# EAGLE design BLM Badge rev B (EAGLE 9.6.2)
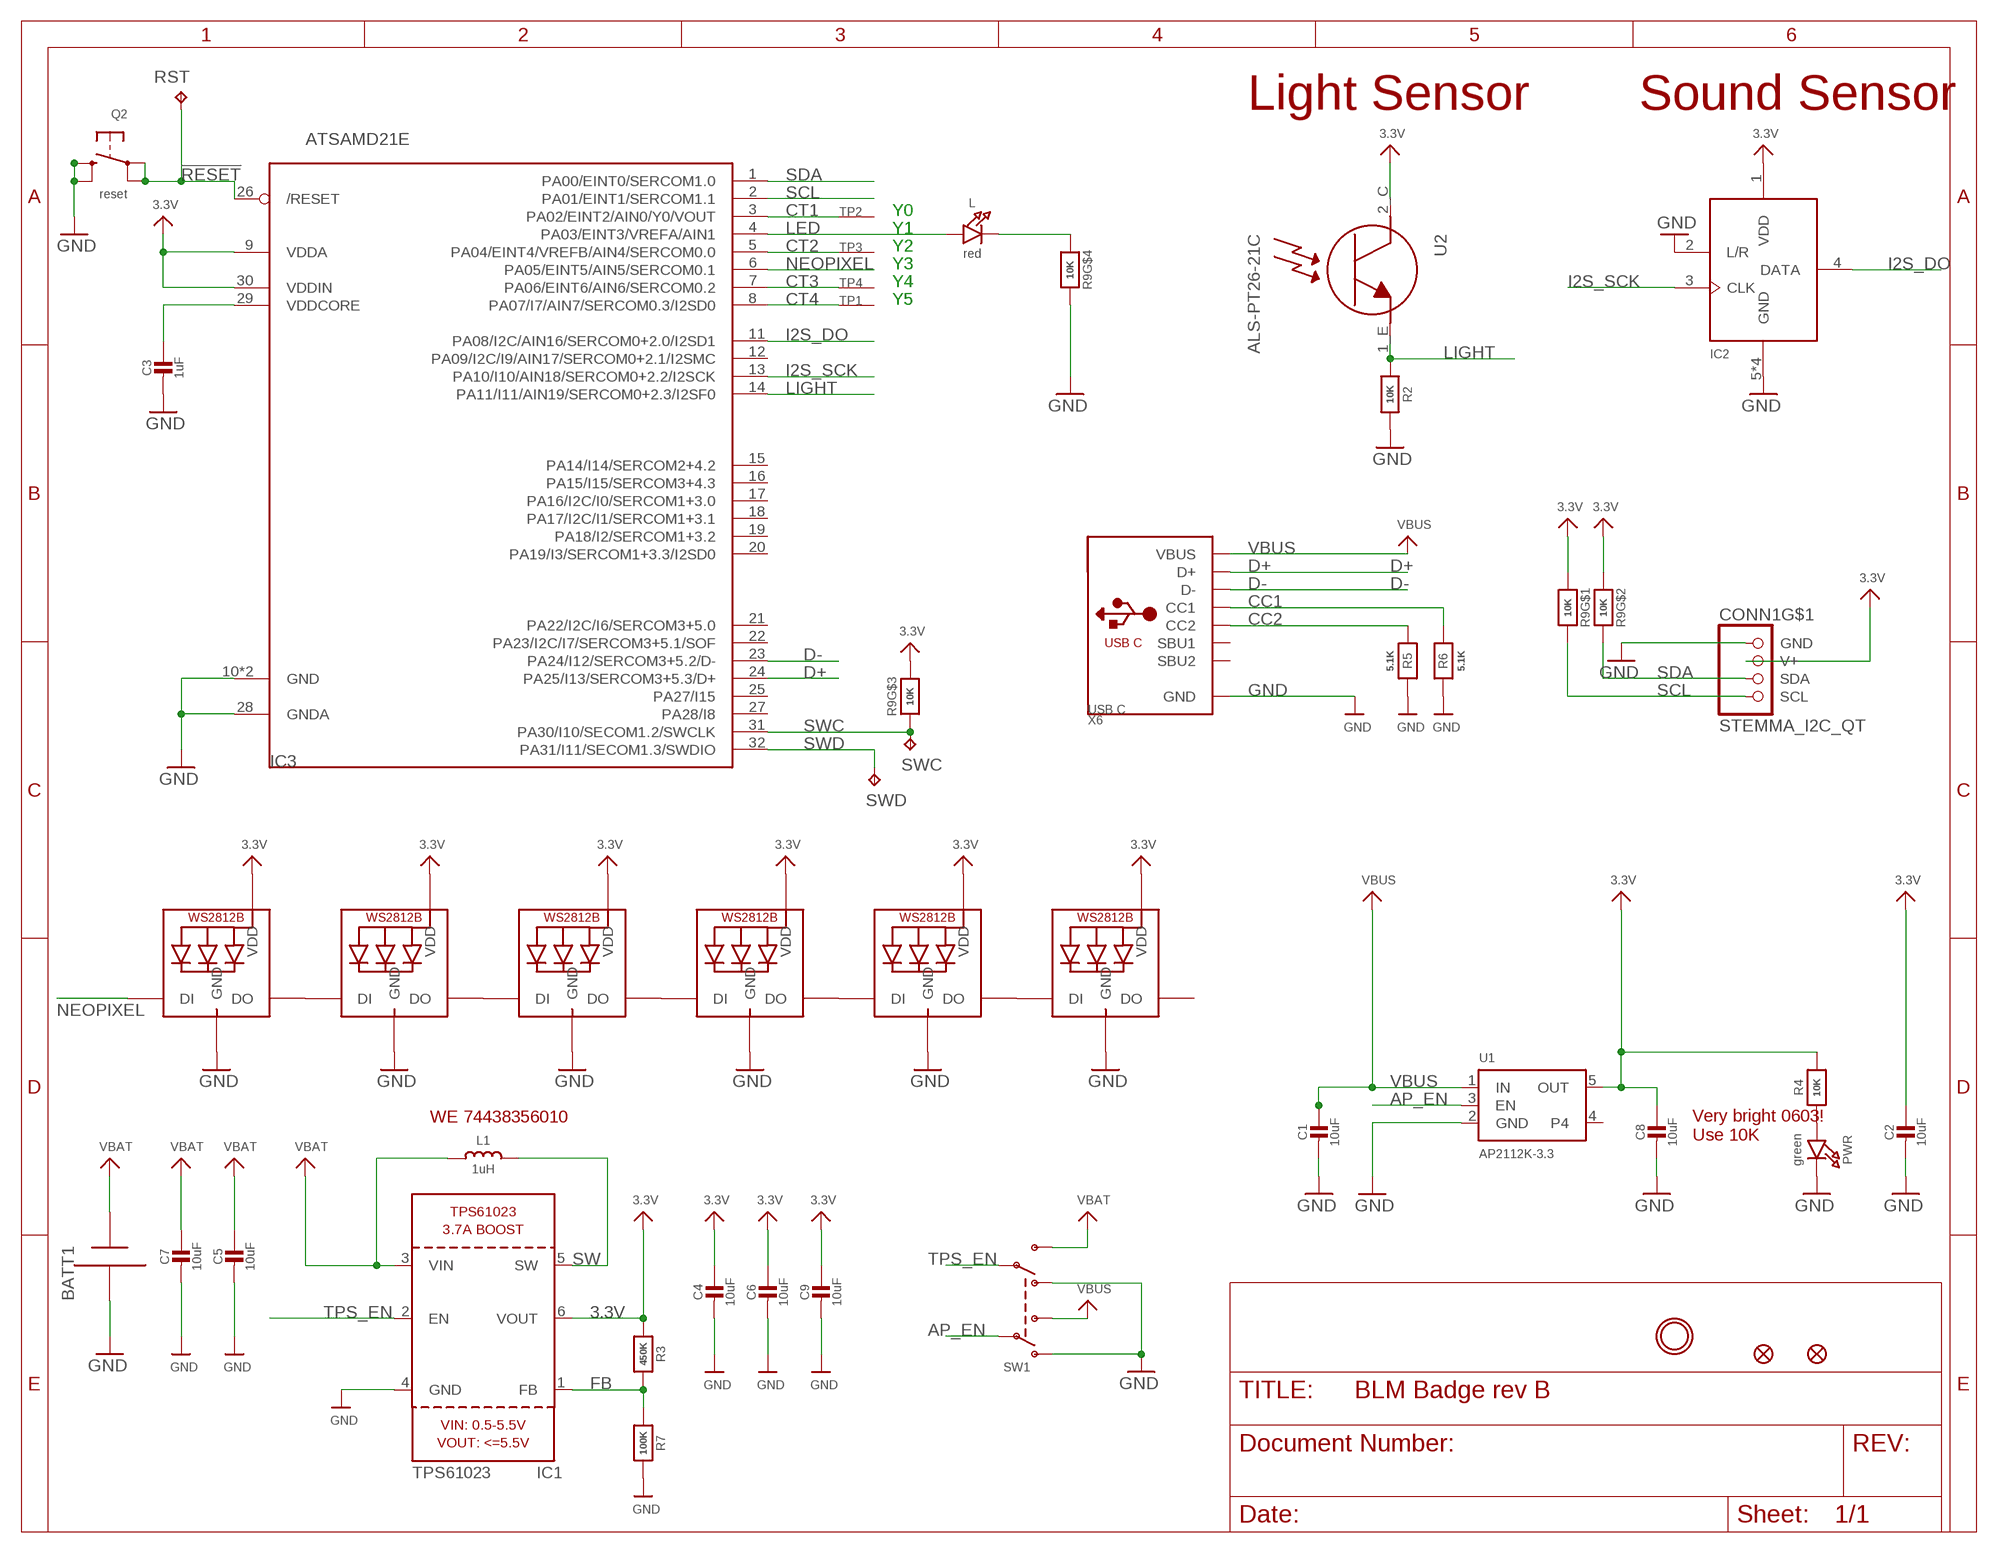
[diagram p0: schematic, sheet 1]

## Parts
BATT1  BATTERYHOLDER_2XAAA  [2XAAA]
C1  10uF  CAP_CERAMIC0805-NOOUTLINE  [0805-NO]
C2  10uF  CAP_CERAMIC0805-NOOUTLINE  [0805-NO]
C3  1uF  CAP_CERAMIC0603_NO  [0603-NO]
C4  10uF  CAP_CERAMIC0805-NOOUTLINE  [0805-NO]
C5  10uF  CAP_CERAMIC0805-NOOUTLINE  [0805-NO]
C6  10uF  CAP_CERAMIC0805-NOOUTLINE  [0805-NO]
C7  10uF  CAP_CERAMIC0805-NOOUTLINE  [0805-NO]
C8  10uF  CAP_CERAMIC0805-NOOUTLINE  [0805-NO]
C9  10uF  CAP_CERAMIC0805-NOOUTLINE  [0805-NO]
CONN1  STEMMA_I2C_QT  [JST_SH4]
FID1  FIDUCIAL_1MM  [FIDUCIAL_1MM]
FID2  FIDUCIAL_1MM  [FIDUCIAL_1MM]
IC1  TPS61023  [SOT563]
IC2  MIC_PDM  MIC_PDM_SPK0415  [SPK0415HM4H]
IC3  ATSAMD21E  [QFN32_5MM]
L  red  LED0603_NOOUTLINE  [CHIPLED_0603_NOOUTLINE]
L1  1uH  INDUCTORTDK_VLC5045  [INDUCTOR_5X5MM_TDK_VLC5045]
LED2  WS2812B_4020  [WS2812B_4020]
LED3  WS2812B_4020  [WS2812B_4020]
LED4  WS2812B_4020  [WS2812B_4020]
LED5  WS2812B_4020  [WS2812B_4020]
LED6  WS2812B_4020  [WS2812B_4020]
LED7  WS2812B_4020  [WS2812B_4020]
PWR  green  LED0603_NOOUTLINE  [CHIPLED_0603_NOOUTLINE]
Q2  reset  SWITCH_TACT_SMT4.6X2.8  [BTN_KMR2_4.6X2.8]
R2  10K  RESISTOR_0603_NOOUT  [0603-NO]
R3  450K  RESISTOR_0603_NOOUT  [0603-NO]
R4  10K  RESISTOR_0603_NOOUT  [0603-NO]
R5  5.1K  RESISTOR_0603_NOOUT  [0603-NO]
R6  5.1K  RESISTOR_0603_NOOUT  [0603-NO]
R7  100K  RESISTOR_0603_NOOUT  [0603-NO]
R9  10K  RESISTOR_4PACK  [RESPACK_4X0603]
RST  TPTP17R  [TP17R]
SW1  SWITCH_DPDTEG1390  [EG1390]
SWC  TPTP17R  [TP17R]
SWD  TPTP17R  [TP17R]
TP1  SEWTAPPCB_ALLIGATOR  [PCB_ALLI]
TP2  SEWTAPPCB_ALLIGATOR  [PCB_ALLI]
TP3  SEWTAPPCB_ALLIGATOR  [PCB_ALLI]
TP4  SEWTAPPCB_ALLIGATOR  [PCB_ALLI]
U1  AP2112K-3.3  VREG_SOT23-5  [SOT23-5]
U2  ALS-PT26-21C  PHOTOTRANSISTOR_PT26-21C  [ALS-PT26-21C]
U$33  MOUNTINGHOLE3.0THIN  [MOUNTINGHOLE_3.0_PLATEDTHIN]
X6  USB C  USB_C  [USB_C_CUSB31-CFM2AX-01-X]

## Nets
3.3V: C2.1 C4.1 C6.1 C8.1 C9.1 CONN1.2(V+) IC1.6(VOUT) IC2.1(VDD) IC3.9(VDDA) IC3.30(VDDIN) LED2.2(VDD) LED3.2(VDD) LED4.2(VDD) LED5.2(VDD) LED6.2(VDD) LED7.2(VDD) R3.1 R4.2 R9.1 R9.2 R9.6 U1.5(OUT) U2.2_C(C)
!RESET: IC3.26(/RESET) Q2.A'(P1) Q2.A(P) RST.TP
AP_EN: SW1.P1 U1.3(EN)
CC1: R6.2 X6.A5(CC1)
CC2: R5.2 X6.B5(CC2)
CT1: IC3.3(PA02/EINT2/AIN0/Y0/VOUT) TP2.P$1(SEW)
CT2: IC3.5(PA04/EINT4/VREFB/AIN4/SERCOM0.0) TP3.P$1(SEW)
CT3: IC3.7(PA06/EINT6/AIN6/SERCOM0.2) TP4.P$1(SEW)
CT4: IC3.8(PA07/I7/AIN7/SERCOM0.3/I2SD0) TP1.P$1(SEW)
D+: IC3.24(PA25/I13/SERCOM3+5.3/D+) X6.A6(D+) X6.B6(D+)
D-: IC3.23(PA24/I12/SERCOM3+5.2/D-) X6.A7(D-) X6.B7(D-)
FB: IC1.1(FB) R3.2 R7.1
GND: BATT1.MINUS(-) C1.2 C2.2 C3.2 C4.2 C5.2 C6.2 C7.2 C8.2 C9.2 CONN1.1(GND) IC1.4(GND) IC2.2(L/R) IC2.5(GND) IC2.6(GND) IC2.7(GND) IC2.8(GND) IC3.10(GND) IC3.28(GNDA) IC3.33(GND) LED2.4(GND) LED3.4(GND) LED4.4(GND) LED5.4(GND) LED6.4(GND) LED7.4(GND) PWR.C Q2.B'(S1) Q2.B(S) R2.1 R5.1 R6.1 R7.2 R9.5 SW1.O1 SW1.O2 U1.2(GND) X6.A1B12(GND) X6.B1A12(GND)
I2S_DO: IC2.4(DATA) IC3.11(PA08/I2C/AIN16/SERCOM0+2.0/I2SD1)
I2S_SCK: IC2.3(CLK) IC3.13(PA10/I10/AIN18/SERCOM0+2.2/I2SCK)
LED: IC3.4(PA03/EINT3/VREFA/AIN1) L.A
LIGHT: IC3.14(PA11/I11/AIN19/SERCOM0+2.3/I2SF0) R2.2 U2.1_E(E)
N$1: L.C R9.4
N$6: PWR.A R4.1
N$10: LED2.3(DO) LED3.1(DI)
N$11: LED3.3(DO) LED4.1(DI)
N$12: LED4.3(DO) LED5.1(DI)
N$13: LED6.3(DO) LED7.1(DI)
N$16: LED5.3(DO) LED6.1(DI)
NEOPIXEL: IC3.6(PA05/EINT5/AIN5/SERCOM0.1) LED2.1(DI)
SCL: CONN1.4(SCL) IC3.2(PA01/EINT1/SERCOM1.1) R9.8
SDA: CONN1.3(SDA) IC3.1(PA00/EINT0/SERCOM1.0) R9.7
SW: IC1.5(SW) L1.P$2
SWC: IC3.31(PA30/I10/SECOM1.2/SWCLK) R9.3 SWC.TP
SWD: IC3.32(PA31/I11/SECOM1.3/SWDIO) SWD.TP
TPS_EN: IC1.2(EN) SW1.P2
VBAT: BATT1.PLUS(+) C5.1 C7.1 IC1.3(VIN) L1.P$1 SW1.S2
VBUS: C1.1 SW1.S1 U1.1(IN) X6.A4B9(VBUS) X6.B4A9(VBUS)
VDDCORE: C3.1 IC3.29(VDDCORE)
Unconnected: CONN1.MT1(MT) CONN1.MT2(MT) IC3.12(PA09/I2C/I9/AIN17/SERCOM0+2.1/I2SMC) IC3.15(PA14/I14/SERCOM2+4.2) IC3.16(PA15/I15/SERCOM3+4.3) IC3.17(PA16/I2C/I0/SERCOM1+3.0) IC3.18(PA17/I2C/I1/SERCOM1+3.1) IC3.19(PA18/I2/SERCOM1+3.2) IC3.20(PA19/I3/SERCOM1+3.3/I2SD0) IC3.21(PA22/I2C/I6/SERCOM3+5.0) IC3.22(PA23/I2C/I7/SERCOM3+5.1/SOF) IC3.25(PA27/I15) IC3.27(PA28/I8) LED7.3(DO) U1.4 X6.A8(SBU1) X6.B8(SBU2)

## Notes on the sheet
- Light Sensor | Sound Sensor
- Y0
- Y1
- Y2
- Y3
- Y4
- Y5
- WE 74438356010
- Very bright 0603!
  Use 10K

## Library data of the parts
BATT1 = adafruit_power:BATTERYHOLDER: AAA PC pin holder Mouser part #12BH412 - but pretty much any 1x AAA battery holder should be the same http://www.ladyada.net/library/pcb/eaglelibrary.html
C1-C9 = microbuilder:CAP_CERAMIC: Ceramic Capacitors For new designs, use the packages preceded by an '_' character since they are more reliable: The following footprints should be used on most boards: _0402 - Standard footprint for regular board layouts _0603 - Standard footprint for regular board layouts _0805 - Standard footprint for regular board layouts _1206 - Standard footprint for regular board layouts For extremely tight-pitch boards where space is at a premium, the following 'micro-pitch' footprints can be used (smaller pads, no silkscreen outline, etc.): _0402MP - Micro-pitch footprint for very dense/compact boards _0603MP - Micro-pitch footprint for very dense/compact boards _0805MP - Micro-pitch footprint for very dense/compact boards _1206MP - Micro-pitch footprint for very dense/compact boards
CONN1 = microbuilder:STEMMA_I2C
FID1 FID2 = microbuilder:FIDUCIAL: Fiducial Alignment Points Various fiducial points for machine vision alignment.; BOM: EXCLUDE
IC1 = adafruit_power:TPS61023
IC2 = microbuilder:MIC_PDM
IC3 = adafruit_micro:ATSAMD21E
L PWR = microbuilder:LED: LED 0603 - 0603 Surface Mount Package 2mA: Green LED - Low Power (3.9mcd, 2ma, 1.7Vf) - Digikey: 475-2709-2-ND Orange LED - Low Power (9.8mcd, 2ma, 1.8Vf) - Digikey: 475-1194-2-ND Red LED - Low Power (5mcd, 2ma, 1.8Vf) - Digikey: 475-1195-2-ND Yellow LED - Low Power (7mcd, 2ma, 1.8Vf) - Digikey: 475-1196-2-ND 5mA: Blue LED - Low Power (17mcd, 5ma, 2.9Vf) - Digikey: LNJ937W8CRACT-ND 0805 - 0805 Surface Mount Package 2mA: Red LED (8.8mcd, 2mA, 1.8Vf, Clear) - Low Power [Digikey: 475-2510-1-ND] Green LED (5mcd, 2mA, 1.8Vf, Clear) - Low Power [Digikey: 475-2730-1-ND] Yellow LED (11.3mcd, 2mA, 1.8Vf, Clear) - Low Power [Digikey: 475-2555-1-ND] 20mA: Red LED (104mcd, 20mA, Diffused) - LS R976 [Digikey: 475-1278-6-ND] Red LED (12mcd, 20mA, 2.0Vf, Clear) - APT2012EC [Digikey: 754-1128-1-ND] Green LED (15mcd, 20mA, 2.2Vf, Clear) - APT2012GC [Digikey: 754-1131-1-ND] Orange LED (160mcd, 20mA, 2.1Vf, Clear) - APT2012SECK [Digikey: 754-1130-1-ND] 1206 - 1206 Surface Mount Package Green LED (26mcd, 20mA, Diffused) - LG N971 [Digikey: 475-1407-6-ND] Red LED (15mcd, 20mA, Diffused) - LH N974 [Digikey: 475-1416-6-ND] Cree - Cree High-Power Surface Mount LEDs XPEBWT-L1-0000-00D50 - White 111lm 350mA 2.9Vf 6200K 110° XTEAWT-00-0000-00000LEE3 - White 114lm 350mA 2.85Vf 5000K 115° Everlight - Everlight 45-21 Series Surface Mount LEDs 45-21/QK2C-B2832AC2CB2/2T - Warm White 2000mcd 20mA 3.25Vf 3050K 120° 45-21/LK2C-B38452C4CB2/2T - Nuetral White 2000mcd 20mA 3.25Vf 4150K 120° 45-21/LK2C-B50634C6CB2/2T - Cold White 2200mcd 20mA 3.25Vf 5650K 120° PLCC2 Reverse Mount LS T77K-J1L2-1-0-2-R18-Z - Red 11.25mcd 2mA 1.8Vf 630nm 120° LO T77K-L1M2-24-Z - Orange 19.6mcd 2mA 1.8Vf 606nm 120° LY T77K-K2M1-26-Z - Yellow 15.7mcd 2mA 1.8Vf 587nm 120°
L1 = microbuilder:INDUCTOR: Inductors 0603: 10nH Ceramic Inductor - microwire antenna/RF (Digikey: 712-1434-2-ND) 0805: 560nH Ceramic Inductor - RF (Digikey: 553-1047-1-ND) 270nH Ceramic Inductor - Q = 40@250MHz, +-5%, 1 Ohm DC Resistance (Digikey: 535-10506-2-ND) 1007 (2518 Metric) SMT: 10µH 10% 250mOhm 820mA 1007 Inductor (Digikey: 587-2189-1-ND) 22µH 10% 500mOhm 580mA 1007 Inductor (Digikey: 587-2190-1-ND) 47µH 10% 950mOhm 420mA 1007 Inductor (Digikey: 587-2191-1-ND) 47µH 5% 100mOhm 1A 1008 Inductor (Digikey: 732-1816-1-ND) 5.0x5.0mm (Taiyo Yuden NR5040 Series) 6.8µH 20% 2.3A 64mOhm Inductor (Digikey: 587-2374-2-ND) 5.0x5.0mm (TDK VLC5045 Series) 4.7µH 20% 3.3A 34mOhm Inductor (Digikey: 445-6526-1-ND) 6.8µH 20% 2.7A 46mOhm Inductor (Digikey: 445-6527-1-ND) 6.0x6.0mm (TDK VLC6045 Series) 4.7µH 20% 3.8A 27mOhm Inductor (Digikey: 445-6538-2-ND) 6.8µH 20% 3A 41mOhm Inductor (Digikey: 445-6540-1-ND) 6.2µH 30% 2.2A 45mOhm Inductor (Digikey: SRR5028-6R2YCT-ND) - Not TDK VLC6045 but footprint should match 6.0x6.0mm (TDK SLF6045 Series) 6.8uH 30% 2A 33mOhm Inductor (Digikey: 445-4572-1-ND, Mouser: 810-SLF645T6R8N2R0PF) 6.0x6.0mm (Sumida CDRH5D28 Series) 6.2uH 30% 1.8A 45mOhm Inductor (Digikey: 308-1542-1-ND) Taiyo Yuden NR3015T2R2M - 2.2uH 20% 1.5A (Digikey: 587-1648-2-ND, Mouser: 963-NR3015T2R2M) - Used with TI TPS62172 CoilCraft RFID Transponder Coil - MA5532-AE (For use with AS3935 Lightning Sensor) Taiyo Yuden NRH2412T2R2MNGH - 2.2uH 20% 1AA (Digikey: 587-3443-1-ND) - Used with TI LM3671 Vishay IHLP 1.0uH Molded Inductor - 24mOhm DCR, 5A, +/-20%, -55°C-125°C (Digikey: 541-1319-1-ND)
LED2-LED7 = microbuilder:WS2812B
Q2 = microbuilder:SWITCH_TACT_SMT: SMT Tact Switches 6x6mm - Digikey: P12940SCT-ND KMR2 (4.6x2.8mm) - Digikey: 401-1426-1-ND EVQ-PQHB55 - Light Touch, 160GF (4.5x4.5mm) - Digikey: P8090SCT-ND KMT0 - KMT021 NGJ LHS (etc.) IP68/Waterproof - Digikey: CKN10289CT-ND
R2-R7 = microbuilder:RESISTOR: Resistors For new designs, use the packages preceded by an '_' character since they are more reliable: The following footprints should be used on most boards: _0402 - Standard footprint for regular board layouts _0603 - Standard footprint for regular board layouts _0805 - Standard footprint for regular board layouts _1206 - Standard footprint for regular board layouts For extremely tight-pitch boards where space is at a premium, the following 'micro-pitch' footprints can be used (smaller pads, no silkscreen outline, etc.): _0402MP - Micro-pitch footprint for very dense/compact boards _0603MP - Micro-pitch footprint for very dense/compact boards _0805MP - Micro-pitch footprint for very dense/compact boards _1206MP - Micro-pitch footprint for very dense/compact boards
R9 = microbuilder:RESISTOR_4PACK: Resistor Packs (4 resistors) 4 x 0603 10K 1/16W - Digikey: YC164J-10KCT-ND
RST SWC SWD = testpad:TP: Test pad
SW1 = microbuilder:SWITCH_DPDT: Switch - DPDT A DPDT Switch acts like an SPDT switch, but has a pair of switches instead of just one. Vertical - 0.3A @ 6V SMT - Digikey: JS202011SCQN
TP1-TP4 = microbuilder:SEWTAP
U1 = microbuilder:VREG_SOT23-5: SOT23-5 Fixed Voltage Regulators Part Current Out V Out V In V Dropout θJA (°C/W) TJ (°C) Digikey Part No. ADP121 150mA 3.3V 3.4-5.5V 0.09V @ 150mA -- -- ADP121-AUJZ33R7CT-ND ADP121 150mA 3.0V 3.1-5.5V 0.09V @ 150mA -- -- ADP121-AUJZ30R7CT-ND ADP122 300mA 3.3V 3.4-5.5V 0.085V @ 300mA -- -- ADP122AUJZ-3.3-R7CT-ND ADP1712 300mA 3.3V 3.5-5.5V 0.17V @ 300mA -- -- ADP1712AUJZ-3.3-R7TR-ND AP7311 (Low Cost) 150mA 3.3V 3.5-6V 0.15V @ 150mA -- -- AP7311-33WG-7DICT-ND LD39015M18R 150mA 1.8V 1.9V-5.5V 0.08V @ 100mA -- -- 497-6977-1-ND LP2985A-33DBVR 150mA 3.3V 3.3-16V 0.28V @ 150mA 206 150 296-18479-1-ND MCP1824T-3302E/OT 300mA 3.3V 3.5V-6V 0.2V @ 300mA -- -- MCP1824T-3302E/OTCT-ND MIC5205-2.5YM5 TR 150mA 2.5V 2.7-16V 0.165V @ 150mA -- -- 576-1257-2-ND MIC5205-3.0YM5 TR 150mA 3.0V 3.2V-16V 0.165V @ 150mA -- -- 576-1258-2-ND MIC5205-3.3YM5 TR 150mA 3.3V 3.5V-16V 0.165V @ 150mA -- -- 576-1259-2-ND TPS780330220 150mA 3.3V+2.2V 3.6-5.5V 250mV Max -- -- 296-23332-1-ND TDA3663/N1,135 100mA 3.3V 3.5-45V 0.18V @ 50mA -- -- 568-5343-1-ND Max operating temp can be calculated using θJA, TJ (max junction temperature), and power in watts. Set the "Maximum Ambient Temperature" until it reaches TJ ("Max Junction Temperature"), which is the absolute limit for safe use of the regulator: Heat Sink Temperature Calculator <http://www.daycounter.com/Calculators/Heat-Sink-Temperature-Calculator.phtml> For example, With 12V source into a 3.3V LP2985 and a 30mA load, we are dissipating (12V-3.3V) * 0.03A = 0.261W. With a θJA of 206 °C/W, a TJ of 150°C, and 261mW we can safely use the chip without a heat sink up to 75°C (=147.1°C Junction Temperature).
U2 = microbuilder:PHOTOTRANSISTOR: ALS-PT19-315C - Analog Light Sensor VCC: 2.5-5.5V
U$33 = microbuilder:MOUNTINGHOLE: Mounting Hole For #2 screws (0.086"/2.18mm width, 0.094"/2.4mm hole) use 2.5mm; BOM: EXCLUDE
X6 = microbuilder:USB_C: USB Type-C USB 2.0 Connector

## Net classes
1 power: width 0.305 mm

## Board
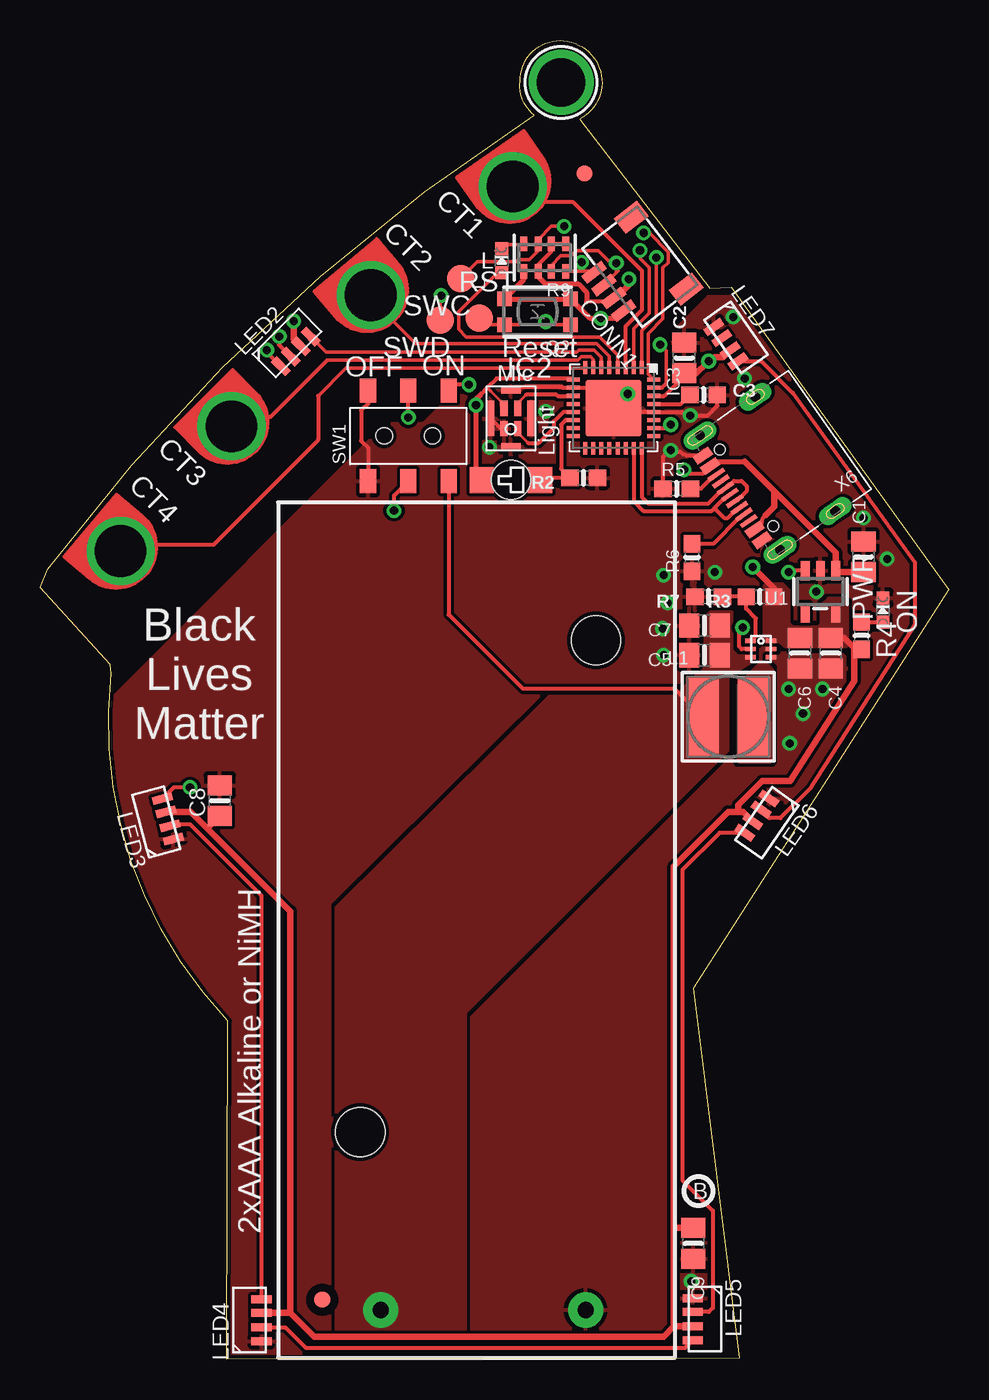
[diagram p1: board, top side]
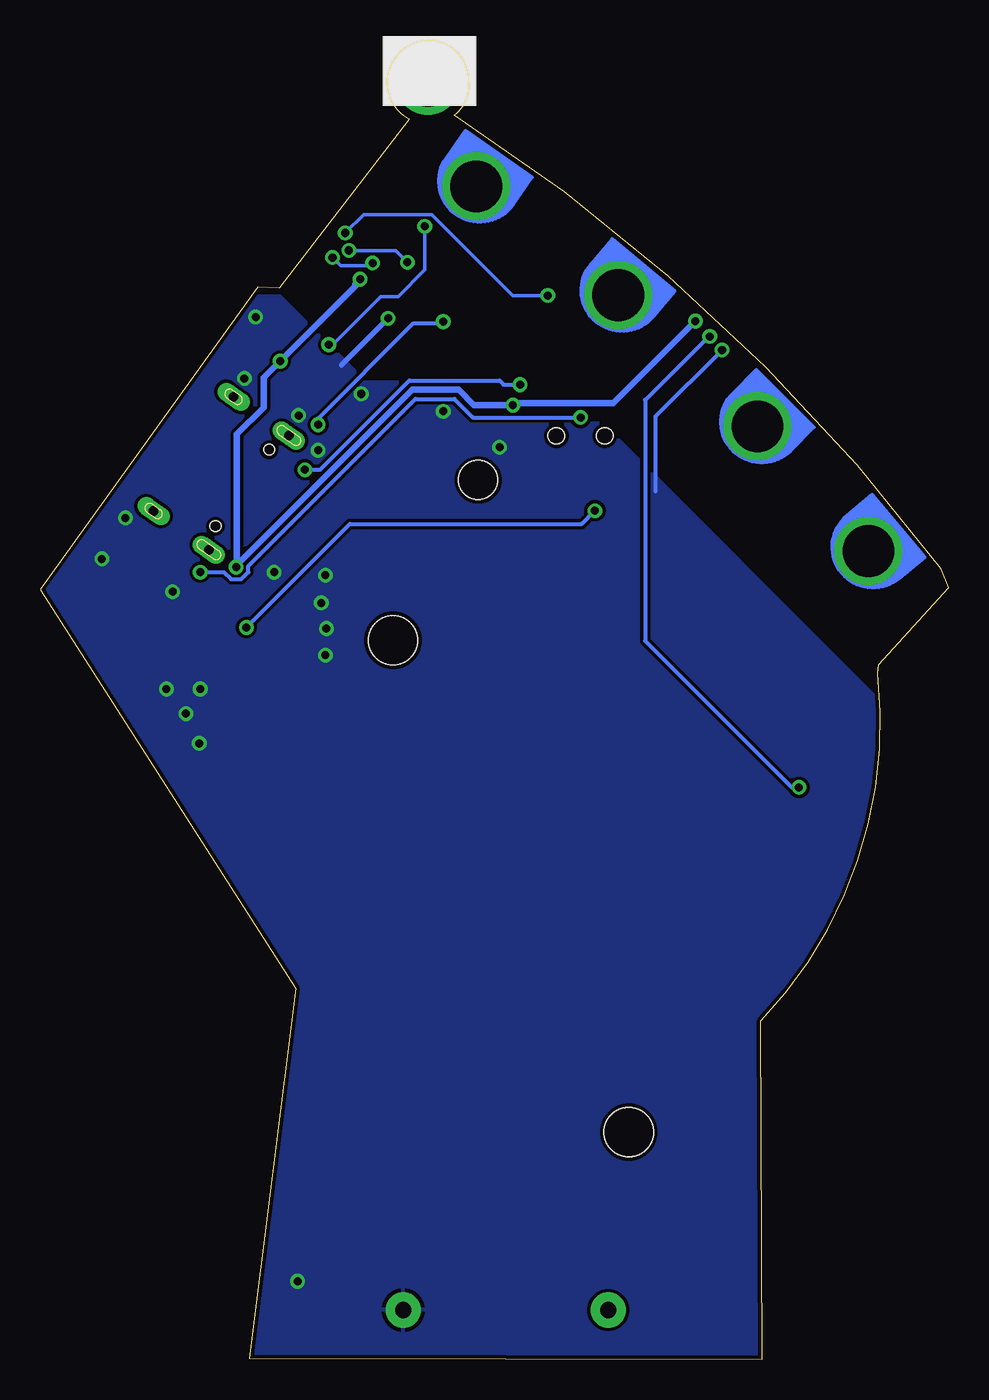
[diagram p2: board, bottom side, seen from below]

Size 56.26 x 81.72 mm. Coordinates in mm from the lower left corner, seen from the top.
Outline: 11.56,0 11.62,20.95 arc-50 4.38,42.48 4.32,43.05 0,47.82 0.44,48.96 arc-20 30.61,77.09 arc-60 29.72,79.18 arc-90 32.19,81.72 arc-90 34.8,79.06 arc-60 33.4,76.83 41.47,66.36 42.8,66.42 56.26,47.69 40.45,22.99 43.31,0.06 11.56,0
Copper layers (1*16): Top 0.035mm / dielectric 1.5mm / Bottom 0.035mm
Design rules "adafruit 7-7": minimum track width 6mil, minimum drill 15.5mil, track to track 8mil, track to pad 7mil, pad to pad 7mil, via to via 7mil, smd to smd 7mil, copper to edge 10mil, drill to drill 8mil, minimum pad ring 10mil, minimum via ring 8mil, stop-mask expansion 2mil, vias tented up to drill 20mil, thermal gap 10mil

### Footprints (pad centres in the part's own frame; a part is rotated, then mirrored left to right if it is on the bottom)
2XAAA = drill 1 pad 2.184: MINUS 50.038,19.05; PLUS 50.038,6.35 | hole 3.048: 39.014,5.08; 8.534,19.685
0805-NO = smd 1.24 x 1.5: 1 -0.95,0; 2 0.95,0
0603-NO = smd 1.075 x 1: 1 -0.85,0; 2 0.85,0
JST_SH4 = smd 0.6 x 1.55: 1 -1.5,2.514; 2 -0.5,2.514; 3 0.5,2.514; 4 1.5,2.514 | smd 1.2 x 1.8: MT1 -2.8,-1.386; MT2 2.8,-1.386
FIDUCIAL_1MM = smd 1 x 1: 1 0,0
SOT563 = smd 0.65 x 0.275: 1 -0.635,0.5; 2 -0.635,0; 3 -0.635,-0.5; 4 0.635,-0.5; 5 0.635,0; 6 0.635,0.5
SPK0415HM4H = smd 0.45 x 0.95: 1 0.425,-0.625; 2 0.425,0.625; 3 -0.425,0.625; 4 -0.425,-0.625 | smd 1.2 x 0.45: 5 0,-1.75; 7 0,1.75 | smd 0.45 x 2.2: 6 1.25,0; 8 -1.25,0
QFN32_5MM = smd 0.8 x 0.25: 1 -2.5,1.75; 2 -2.5,1.25; 3 -2.5,0.75; 4 -2.5,0.25; 5 -2.5,-0.25; 6 -2.5,-0.75; 7 -2.5,-1.25; 8 -2.5,-1.75; 17 2.5,-1.75; 18 2.5,-1.25; 19 2.5,-0.75; 20 2.5,-0.25; 21 2.5,0.25; 22 2.5,0.75; 23 2.5,1.25; 24 2.5,1.75 | smd 0.25 x 0.8: 9 -1.75,-2.5; 10 -1.25,-2.5; 11 -0.75,-2.5; 12 -0.25,-2.5; 13 0.25,-2.5; 14 0.75,-2.5; 15 1.25,-2.5; 16 1.75,-2.5; 25 1.75,2.5; 26 1.25,2.5; 27 0.75,2.5; 28 0.25,2.5; 29 -0.25,2.5; 30 -0.75,2.5; 31 -1.25,2.5; 32 -1.75,2.5 | smd 3.5 x 3.5: 33 0,0
CHIPLED_0603_NOOUTLINE = smd 0.8 x 0.8: A 0,-0.75; C 0,0.75
INDUCTOR_5X5MM_TDK_VLC5045 = smd 2 x 5: P$1 -1.6,0; P$2 1.6,0
WS2812B_4020 = smd 0.5 x 1.25: 1 1.3,-0.75; 2 0.45,-0.75; 3 -0.45,-0.75; 4 -1.3,-0.75
BTN_KMR2_4.6X2.8 = smd 0.9 x 0.9: A 2.05,0.8; A' -2.05,0.8; B 2.05,-0.8; B' -2.05,-0.8
RESPACK_4X0603 = smd 0.45 x 0.9: 1 -1.3,-0.85; 2 -0.4,-0.85; 3 0.4,-0.85; 4 1.3,-0.85; 5 1.3,0.85; 6 0.4,0.85; 7 -0.4,0.85; 8 -1.3,0.85
TP17R = smd 1.7 x 1.7: TP 0,0
EG1390 = smd 1 x 1.5: O1 -2.5,2.8; O2 -2.5,-2.8; P1 0,2.8; P2 0,-2.8; S1 2.5,2.8; S2 2.5,-2.8 | hole 1: 1.5,0; -1.5,0
PCB_ALLI = drill 3.2: P$1 0,0.508
SOT23-5 = smd 0.55 x 1.2: 1 -0.95,-1.3; 2 0,-1.3; 3 0.95,-1.3; 4 0.95,1.3; 5 -0.95,1.3
ALS-PT26-21C = smd 1.5 x 1.6: 1_E -1.8,0; 2_C 1.8,0 | hole 2.4: 0,0
MOUNTINGHOLE_3.0_PLATEDTHIN = drill 3 pad 3.6: P$1 0,0
USB_C_CUSB31-CFM2AX-01-X = smd 0.575 x 1.15: A1B12 -3.2,3.545; A4B9 -2.4,3.545; B1A12 3.2,3.545; B4A9 2.4,3.545 | smd 0.275 x 1.15: A5 -1.25,3.545; A6 -0.25,3.545; A7 0.25,3.545; A8 1.25,3.545; B5 1.75,3.545; B6 0.75,3.545; B7 -0.75,3.545; B8 -1.75,3.545 | drill 0.6 pad 1 long: M1 -4.32,2.97; M2 4.32,2.97; M3 -4.32,-1.21; M4 4.32,-1.21 | hole 0.65: 2.89,2.47; -2.89,2.47

### Placement (x,y rotation side)
BATT1  14.73,53.09 270 top
C1  50.99,49.72 90 top
C2  39.88,62.04 90 top
C3  41.08,59.75 0 top
C4  48.96,43.75 270 top
C5  41.15,43.62 180 top
C6  47.05,43.75 270 top
C7  41.15,45.47 180 top
C8  11.11,34.61 90 top
C9  40.45,7.18 270 top
CONN1  37.21,67.69 127.5 top
FID1  17.46,3.68 0 top
FID2  33.72,73.47 0 top
IC1  44.64,44.01 0 top
IC2  29.15,58.29 180 top
IC3  35.5,58.94 270 top
L  28.57,68.07 0 top
L1  42.61,39.81 0 top
LED2  15.29,62.98 45 top
LED3  7.18,33.29 105 top
LED4  12.95,2.41 90 top
LED5  41.16,2.48 270 top
LED6  45,33.25 235 top
LED7  43.08,63.33 305 top
PWR  52.2,46.42 0 top
Q2  30.8,64.9 180 top
R2  33.66,54.61 180 top
R3  44.58,47.24 180 top
R4  50.86,44.83 270 top
R5  39.42,53.94 0 top
R6  40.37,49.68 90 top
R7  41.4,47.24 180 top
R9  31.24,68.26 180 top
RST  27.18,64.52 0 top
SW1  22.8,57.21 0 top
SWC  26.04,66.97 180 top
SWD  24.77,64.39 180 top
TP1  5.36,49.75 50 top
TP2  29.55,72.26 35 top
TP3  20.79,65.55 40 top
TP4  12.2,57.45 45 top
U1  48.32,47.56 180 top
U2  29.15,54.48 180 top
U$1  [BLM_FRONT]  55.94,-3.11 0 bottom  (outside the outline)
U$33  32.26,79.12 0 top
U$40  [PCBFEAT-REV-040]  40.77,10.41 0 top
X6  45.77,55.4 125 top

### Tracks (layer width: path | path; a pad name or v marks a point on that pad's centre or on a via)
3.3V  (via drill 0.5)
  Top 0.178: 28.55,59.34 27.91,59.98 27.69,60.2
  Top 0.203: IC2.1 28.55,59.09 28.55,59.34 | 27.91,59.98 27.75,60.14 27.63,60.14
  Top 0.254: IC3.30 38.65,59.69 39.78,60.83 C2.1 | IC3.9 32.93,60.77 28.27,60.77 27.69,60.2 | 27.63,60.14 27.3,59.82 | CONN1.2 35.52,65.7 35.34,65.52 33.85,65.52 | R9.6 30.84,67.82 31.64,68.62 R9.2 R9.1
  Top 0.305: U2.2_C 26.99,54.84 v26.99,59.12 26.99,59.5 27.3,59.82 | R9.6 30.84,67.07 31.28,66.63 33.32,66.63 33.85,66.1 33.85,65.52
  Top 0.406: LED4.2 15.49,2.86 | 15.49,2.86 16.95,1.4 38.61,1.4 39.24,2.03 | 39.24,2.03 LED5.2 | LED3.2 9.33,33.91 10.32,32.92 | 15.49,2.86 15.49,27.76 10.32,32.92 | LED7.2 42.3,62.1 41.78,62.1 41.53,61.85 v41.4,61.85 41.4,61.69 41.24,61.69 40.64,61.09 C2.1 | 39.24,2.03 39.24,8.13 | 39.24,8.13 39.24,12.19 39.24,30.54 42.61,33.91 43.24,33.91 | 43.24,33.91 43.53,33.91 LED6.2 | 43.24,33.91 43.24,34.35 44.7,35.81 46.44,35.81 50.42,42.03 50.42,44.07 | LED2.2 15.7,63.21 15.7,64.31 v15.68,64.33 | v44.13,49.09 45.43,47.79 R3.1 | C8.1 10.38,32.92 10.32,32.92 | C9.1 39.25,8.13 39.24,8.13 | C4.1 49.79,44.7 50.42,44.07 | R4.2 50.51,43.98 50.42,44.07 | CONN1.2 35.67,65.76 36.46,66.55 v36.46,66.93
  Bottom 0.406: v15.68,64.33 20.76,59.25 27.05,59.25 27.05,59.18 v26.99,59.12 29.4,59.12 30.35,60.07 33.21,60.07 44.08,49.2 | v44.13,49.09 44.13,49.15 44.08,49.2 | 44.08,49.2 44.08,57.31 42.42,58.98 42.42,60.83 v41.4,61.85 36.77,66.48 36.77,66.62 v36.46,66.93
  pour Top (no thermals): 44.83,47.88 44.83,44.51 45.78,44.51 46.1,44.2 49.91,44.2 49.97,44.26 49.97,46.8 49.66,47.12 48.83,47.12 48.39,46.67 48.39,45.53 48.2,45.34 46.61,45.34 46.35,45.59 46.35,47.62 45.97,48.01 44.96,48.01
!RESET  (via drill 0.5)
  Top 0.203: RST.TP 27.59,64.1 Q2.A 31.31,64.1 | Q2.A' 31.31,64.1 | v31.31,64.29 31.31,64.1
  Top 0.254: IC3.26 39.05,57.69 v39.05,57.91
  Bottom 0.254: v39.05,57.91 39.12,57.98 39.12,58.23 33.15,64.2 31.4,64.2 v31.31,64.29
AP_EN  (via drill 0.5)
  Top 0.254: U1.3 46.45,48.86 v46.35,48.77 | v22.8,58.36 SW1.P1
  Bottom 0.254: v46.35,48.77 44.89,48.77 44.45,48.33 43.82,48.33 43.37,48.77 43.37,49.15 33.03,59.5 30.61,59.5 29.46,58.36 v22.8,58.36
CC1
  Top 0.254: X6.A5 43.35,52.11 43.26,52.11 41.68,50.53 R6.2
CC2
  Top 0.254: X6.B5 41.63,54.57 41.54,54.57 40.91,53.94 R5.2
CT1
  Top 0.254: TP2.P$1 29.26,72.15 29.72,71.69 33.02,71.69 37.28,67.43 37.28,65.03 36.25,64 IC3.3
CT2
  Top 0.203: IC3.5 35.25,62.16 34.48,62.94 23.25,62.94 20.47,65.72 TP3.P$1
CT3
  Top 0.203: IC3.7 34.25,61.95 34.08,62.12 33.51,62.12 33.3,61.91 17.77,61.91
  Top 0.254: TP4.P$1 12.41,58.38 14.25,58.38 17.77,61.91
CT4
  Top 0.203: IC3.8 33.72,61.4 18.92,61.4 17.21,59.69
  Top 0.254: TP1.P$1 5.35,50.46 10.71,50.46 17.21,56.96 17.21,59.69
D+
  Top 0.254: IC3.24 37.25,53.42 37.66,53.02 41.39,53.02 42.11,53.75 42.21,53.75 X6.B6 42.68,54.22 42.96,54.42 43.43,54.42 43.75,54.1 43.75,53.78 43.18,53.21 43.11,53.21 43.06,53.16 X6.A6
D-
  Top 0.254: IC3.23 36.75,53.16 37.35,52.57 41.58,52.57 41.81,52.8 | X6.A7 42.68,53.57 42.39,53.29 42.3,53.29 41.81,52.8 | 41.81,52.8 41.81,52.67 42.35,52.13 42.59,52.13 43.02,52.57 43.11,52.57 X6.B7
FB
  Top 0.254: IC1.1 44.32,44.82 44.32,45.91 43.73,46.51 R3.2 R7.1
GND  (via drill 0.5)
  Top 0.254: IC2.2 28.52,57.67 IC2.6 | IC2.5 29.37,60.26 32.32,60.26 32.39,60.19 IC3.10 34.25,60.19 IC3.33 | IC3.33 35.75,58.69 IC3.28 39.73,58.69 39.94,58.48 41.34,58.48 41.93,59.08 C3.2 | IC3.33 v36.38,59.82 v36.39,59.82 | X6.B1A12 40.01,55.99 39.94,56.07 39.82,56.07 39.69,56.2 38.86,56.2 38.57,55.9 R5.1 | SW1.O1 20.3,59.22 19.88,58.8 19.88,56.9 20.3,56.47 SW1.O2 | v14.03,62.54 14.03,62.4 LED2.4
  Top 0.305: R9.5 29.94,66.9 Q2.B Q2.B' 34.03,64.52 34.92,64.52 | CONN1.1 35.68,64.52 34.92,64.52 | 34.92,64.52 34.91,64.5 v34.72,64.5
  Bottom 0.254: v14.03,62.54 18.16,58.41 18.16,53.78
  Bottom 0.305: v34.72,64.5 37.59,61.63 37.59,61.59
  other vias: 31.31,58.74 39.05,56.32 46.35,41.53 48.45,41.53 47.24,40.01 46.42,38.16 38.61,43.62 38.54,45.28 38.86,46.86 38.61,48.58 41.78,48.77 48.07,47.56 50.99,52.13 52.45,49.59 40.32,4.83 42.93,64.58 27.81,56.52 40.26,58.48 43.62,60.77
  pour Top (rank 3): 11.37,0 11.37,20.7 4.32,27.75 4.32,40.83 21.46,57.98 23.75,57.98 26.29,60.52 36.07,60.52 41.4,65.85 42.99,65.85 56.71,52.13 56.71,37.66 41.4,22.35 44.58,19.18 44.58,-0.44 11.81,-0.44
  pour Bottom (rank 3): 11.37,0 11.37,20.7 4.32,27.75 4.32,40.83 21.46,57.98 23.75,57.98 26.29,60.52 36.07,60.52 41.4,65.85 42.99,65.85 56.71,52.13 56.71,37.66 41.4,22.35 44.58,19.18 44.58,-0.44 11.81,-0.44
  pour Top (rank 2, no thermals): 45.02,43.62 49.72,43.62 49.78,43.56 49.78,41.91 49.47,41.59 45.97,41.59 45.78,41.78 45.72,41.85 45.72,43.05 45.34,43.43 45.02,43.43
I2S_DO
  Top 0.178: 30.09,59.76 29.57,59.24 IC2.4
  Top 0.254: IC3.11 32.05,59.69 31.99,59.76 30.09,59.76
I2S_SCK
  Top 0.178: 30.22,56.77 29.57,57.42 IC2.3
  Top 0.254: 30.22,56.77 30.86,56.77 31.8,57.71 31.8,58.1 32.39,58.69 IC3.13
LED
  Top 0.203: 28.32,67.32 25.91,64.91 25.91,63.82 26.38,63.34 34.65,63.34 35.75,62.23 IC3.4
  Top 0.254: L.A 28.32,67.32
LIGHT
  Top 0.254: IC3.14 32.54,58.19 32.26,57.91 32.26,55.16 R2.2 31.07,54.61 U2.1_E
N$1
  Top 0.203: L.C 28.8,69.05 29.88,69.05 R9.4
N$6
  Top 0.254: R4.1 52.18,45.68 PWR.A
N$10  (via drill 0.5)
  Top 0.254: v14.8,63.37 14.8,62.84 LED2.3 | v9.27,35.43 8.27,35.43 LED3.1
  Bottom 0.254: v14.8,63.37 14.86,63.37 18.8,59.44 18.8,44.51 9.72,35.43 v9.27,35.43
N$11
  Top 0.254: LED4.1 13.7,28.71 9.27,33.15 8.13,33.15 LED3.3
N$12
  Top 0.254: LED4.3 15.18,1.96 16.45,0.7 39.93,0.7 LED5.1
N$13
  Top 0.254: LED7.1 44.66,61.83 46.62,59.87 54.17,49.37 54.17,45.48 47.7,35.38 45.85,33.53 45.17,33.53 LED6.3
N$16
  Top 0.254: LED6.1 42.07,32.62 39.78,30.32 39.78,12.41 39.78,11.09 41.66,9.21 41.66,3.18 41.41,2.93 LED5.3
NEOPIXEL
  Top 0.203: IC3.6 34.75,62.08 34.31,62.53 33.35,62.53 33.22,62.41 17.7,62.41 LED2.1
SCL  (via drill 0.5)
  Top 0.203: R9.8 33.53,67.41 | 33.53,67.41 34.24,67.41 CONN1.4 | IC3.2 36.75,63.87 37.72,64.83 37.72,67.63 37.15,68.2 v37.15,68.71 | v33.53,67.97 33.53,67.41
  Bottom 0.203: v37.15,68.71 34.26,68.71 v33.53,67.97
SDA  (via drill 0.5)
  Top 0.203: R9.7 31.64,67.77 32.25,68.38 32.88,68.38 33.21,68.71 34.54,68.71 35.8,67.45 35.68,67.32 | 35.68,67.32 CONN1.3 | IC3.1 37.25,63.73 38.16,64.64 v38.16,68.26 | v35.68,67.93 35.68,67.32
  Bottom 0.203: v38.16,68.26 37.66,67.75 35.87,67.75 35.69,67.93 v35.68,67.93
SW
  pour Top (no thermals): 43.24,37.08 43.24,41.78 44.58,43.12 44.58,43.94 44.7,44.07 45.53,44.07 45.53,43.94 44.89,43.94 44.83,43.88 44.83,43.24 45.34,42.74 45.34,37.15 45.21,37.02 43.31,37.02
SWC  (via drill 0.5)
  Top 0.203: SWC.TP 27.08,68.01 29.47,68.01 29.6,68.14 30.3,68.14 30.84,68.69 R9.3 30.84,69.38 31.66,70.2 v32.45,70.2 | 38.76,60.45 38.76,62.5 v38.39,62.86
  Top 0.254: IC3.31 38.5,60.19 38.76,60.45
  Bottom 0.203: v38.39,62.86 38.16,62.86 35.18,65.85 34.1,65.85 32.45,67.5 v32.45,70.2
SWD  (via drill 0.5)
  Top 0.203: IC3.32 37.66,61.04 37.66,63.57 38.57,64.47 38.57,67.63 38.9,67.96 38.9,68.61 37.71,69.79 v37.37,69.79 | v24.83,65.91 24.77,65.85 SWD.TP
  Bottom 0.203: v37.37,69.79 36.23,70.93 32.01,70.93 26.99,65.91 v24.83,65.91
TPS_EN  (via drill 0.5)
  Top 0.254: IC1.2 43.43,44.01 43.31,44.13 43.31,45.15 v43.5,45.34 | v21.91,52.58 21.91,53.52 SW1.P2
  Bottom 0.254: v43.5,45.34 37.08,51.75 22.73,51.75 v21.91,52.58
VBAT
  Top 0.254: SW1.S2 25.3,46.14 29.91,41.53 39.29,41.53 L1.P$1
  pour Top (no thermals): 18.35,1.78 18.35,27.99 31.55,41.07 39.36,41.07 41.21,42.93 41.21,45.97 41.53,46.29 42.8,46.29 42.8,43.94 43.18,43.56 43.94,43.56 43.94,43.18 42.55,42.29 42.55,37.72 26.29,21.46 26.29,1.78
VBUS  (via drill 0.5)
  Top 0.254: X6.A4B9 44.25,51.42 44.66,51.71 44.72,52.08 44.94,52.3 | v39.88,55.12 40.15,54.85 41.01,54.85 X6.B4A9 | SW1.S1 25.3,60.2 25.48,60.39 v26.54,60.39
  Top 0.305: X6.B4A9 41.78,55.62 43.63,55.62
  Top 0.406: 43.63,55.62 45.47,53.78 | 44.94,52.3 45.47,52.83 45.47,53.78 | 45.47,53.78 49.27,49.98 U1.1 49.27,48.97 49.52,48.77 C1.1
  Bottom 0.254: v39.88,55.12 38.93,55.12 33.4,60.64 27.81,60.64 27.56,60.39 v26.54,60.39
VDDCORE
  Top 0.254: IC3.29 39.67,59.19 C3.1

### Text on the board
tPlace: CT1 | CT2 | L | OFF | ON | Reset | Mic | Light | CT3 | CT4 | ON | Black / Lives / Matter | 2xAAA Alkaline or NiMH